# EAGLE design board1 (EAGLE 8.6.0)
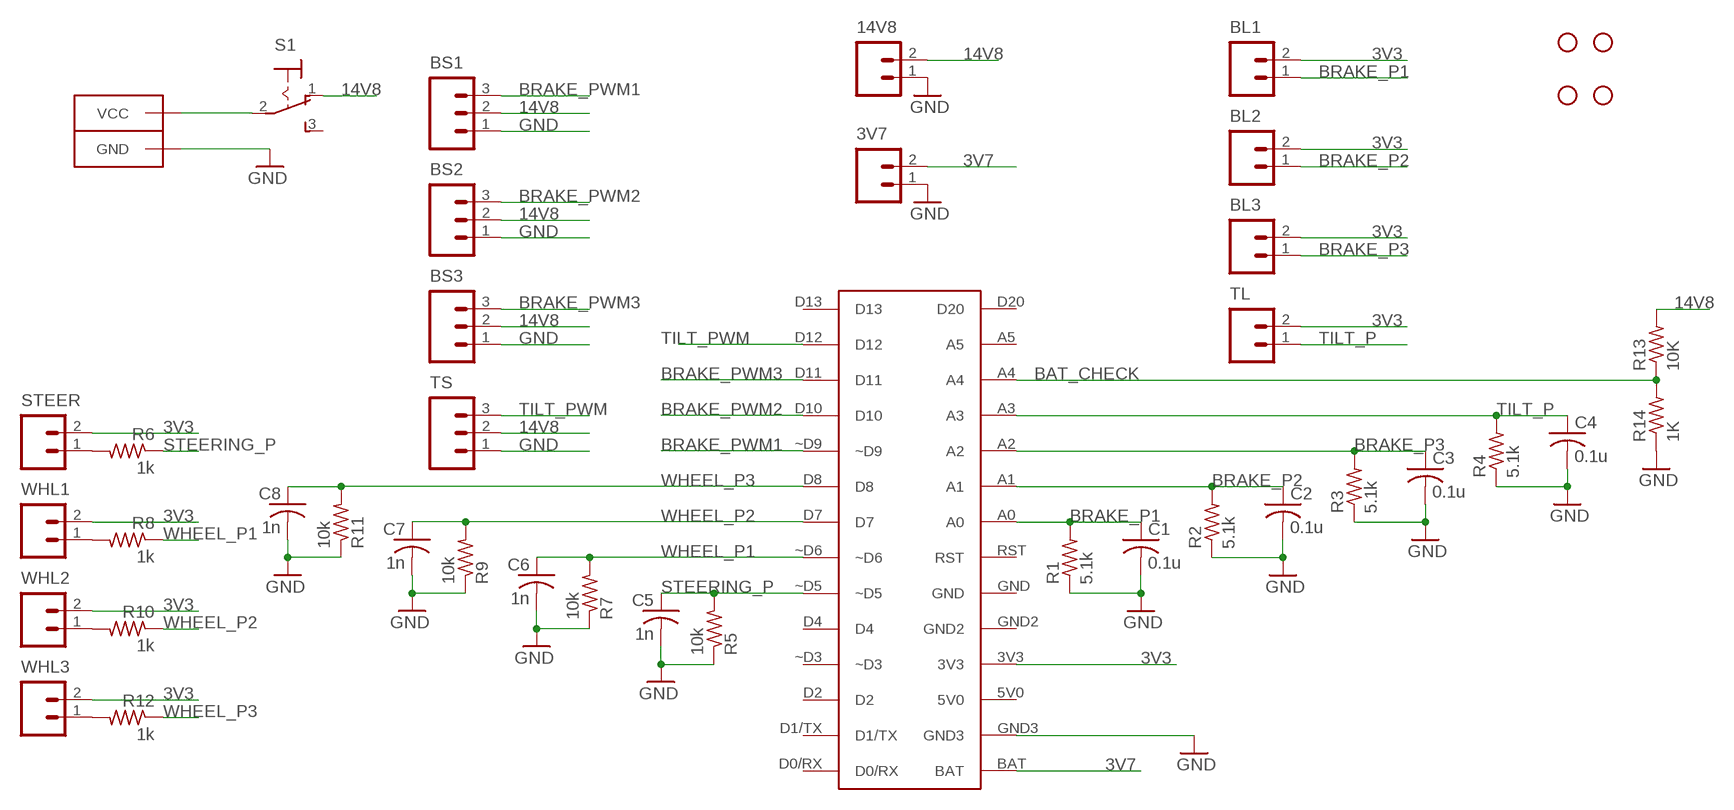
[diagram p0: schematic, sheet 1]

## Parts
3V7  M02PTH  [1X02]
14V8  M02PTH  [1X02]
BL1  M02PTH  [1X02]
BL2  M02PTH  [1X02]
BL3  M02PTH  [1X02]
BS1  M03PTH  [1X03]
BS2  M03PTH  [1X03]
BS3  M03PTH  [1X03]
C1  0.1u  C-USC0603  [C0603]
C2  0.1u  C-USC0603  [C0603]
C3  0.1u  C-USC0603  [C0603]
C4  0.1u  C-USC0603  [C0603]
C5  1n  C-USC0603  [C0603]
C6  1n  C-USC0603  [C0603]
C7  1n  C-USC0603  [C0603]
C8  1n  C-USC0603  [C0603]
JP13  STAND-OFF  [STAND-OFF]
JP14  STAND-OFF  [STAND-OFF]
JP15  STAND-OFF  [STAND-OFF]
JP16  STAND-OFF  [STAND-OFF]
LIPO  ANDERSONHORIZONTAL  [ANDERSON_HORIZONTAL]
R1  5.1k  R-US_R0603  [R0603]
R2  5.1k  R-US_R0603  [R0603]
R3  5.1k  R-US_R0603  [R0603]
R4  5.1k  R-US_R0603  [R0603]
R5  10k  R-US_R0603  [R0603]
R6  1k  R-US_R0603  [R0603]
R7  10k  R-US_R0603  [R0603]
R8  1k  R-US_R0603  [R0603]
R9  10k  R-US_R0603  [R0603]
R10  1k  R-US_R0603  [R0603]
R11  10k  R-US_R0603  [R0603]
R12  1k  R-US_R0603  [R0603]
R13  10K  R-US_R0603  [R0603]
R14  1K  R-US_R0603  [R0603]
S1  M9040P  [M9040P]
STEER  M02PTH  [1X02]
TL  M02PTH  [1X02]
TS  M03PTH  [1X03]
U$1  CURIENANO_BREAKOUT  [CURIENANO]
WHL1  M02PTH  [1X02]
WHL2  M02PTH  [1X02]
WHL3  M02PTH  [1X02]

## Nets
3V3: BL1.2 BL2.2 BL3.2 STEER.2 TL.2 U$1.3V3 WHL1.2 WHL2.2 WHL3.2
3V7: 3V7.2 U$1.BAT
14V8: 14V8.2 BS1.2 BS2.2 BS3.2 R13.2 S1.1(O) TS.2
BAT_CHECK: R13.1 R14.2 U$1.A4
BRAKE_P1: BL1.1 C1.1 R1.2 U$1.A0
BRAKE_P2: BL2.1 C2.1 R2.2 U$1.A1
BRAKE_P3: BL3.1 C3.1 R3.2 U$1.A2
BRAKE_PWM1: BS1.3 U$1.~D9
BRAKE_PWM2: BS2.3 U$1.D10
BRAKE_PWM3: BS3.3 U$1.D11
GND: 3V7.1 14V8.1 BS1.1 BS2.1 BS3.1 C1.2 C2.2 C3.2 C4.2 C5.2 C6.2 C7.2 C8.2 LIPO.PIN1(GND) LIPO.PIN1-LEAD(GND) R1.1 R2.1 R3.1 R4.1 R5.1 R7.1 R9.1 R11.1 R14.1 TS.1 U$1.GND3
N$1: R6.2 STEER.1
N$2: R8.2 WHL1.1
N$3: R10.2 WHL2.1
N$4: R12.2 WHL3.1
N$5: LIPO.PIN2(VCC) LIPO.PIN2-LEAD(VCC) S1.2(P)
STEERING_P: C5.1 R5.2 R6.1 U$1.~D5
TILT_P: C4.1 R4.2 TL.1 U$1.A3
TILT_PWM: TS.3 U$1.D12
WHEEL_P1: C6.1 R7.2 R8.1 U$1.~D6
WHEEL_P2: C7.1 R9.2 R10.1 U$1.D7
WHEEL_P3: C8.1 R11.2 R12.1 U$1.D8
Unconnected: S1.3(S) U$1.5V0 U$1.A5 U$1.D0/RX U$1.D1/TX U$1.D2 U$1.D4 U$1.D13 U$1.D20 U$1.GND U$1.GND2 U$1.RST U$1.~D3

## Library data of the parts
3V7 14V8 BL1-BL3 STEER TL WHL1-WHL3 = ee192:M02: 2-pin 0.1-inch header and MTA connector Courtsey of Pioneers in Engineering; PIE-INT-REF-NUM: BULK-STOCK
BS1-BS3 TS = ee192:M03: 3-pin 0.1-inch header and MTA connector Courtsey of Pioneers in Engineering; PIE-INT-REF-NUM: BULK-STOCK
C1-C8 = adafruit:C-US: CAPACITOR, American symbol
JP13-JP16 = ee192:STAND-OFF: Stand Off This is the mechanical footprint for a #4 phillips button head screw. Use the keepout ring to avoid running the screw head into surrounding components. SKU : PRT-00447
LIPO = ee192:ANDERSON: 2-pin 25A Anderson Connector http://www.alliedelec.com/images/products/datasheets/bm/ANDERSON_POWER_PRODUCTS/70162018.pdf; PIE-INT-REF-NUM: Anderson
R1-R14 = resistor:R-US_: RESISTOR, American symbol
S1 = switch:M9040P: TOGGLE SWITCH Marquardt
U$1 = Curie Nano:CURIENANO_BREAKOUT

## Net classes
0 default: width 0.508 mm

## Board
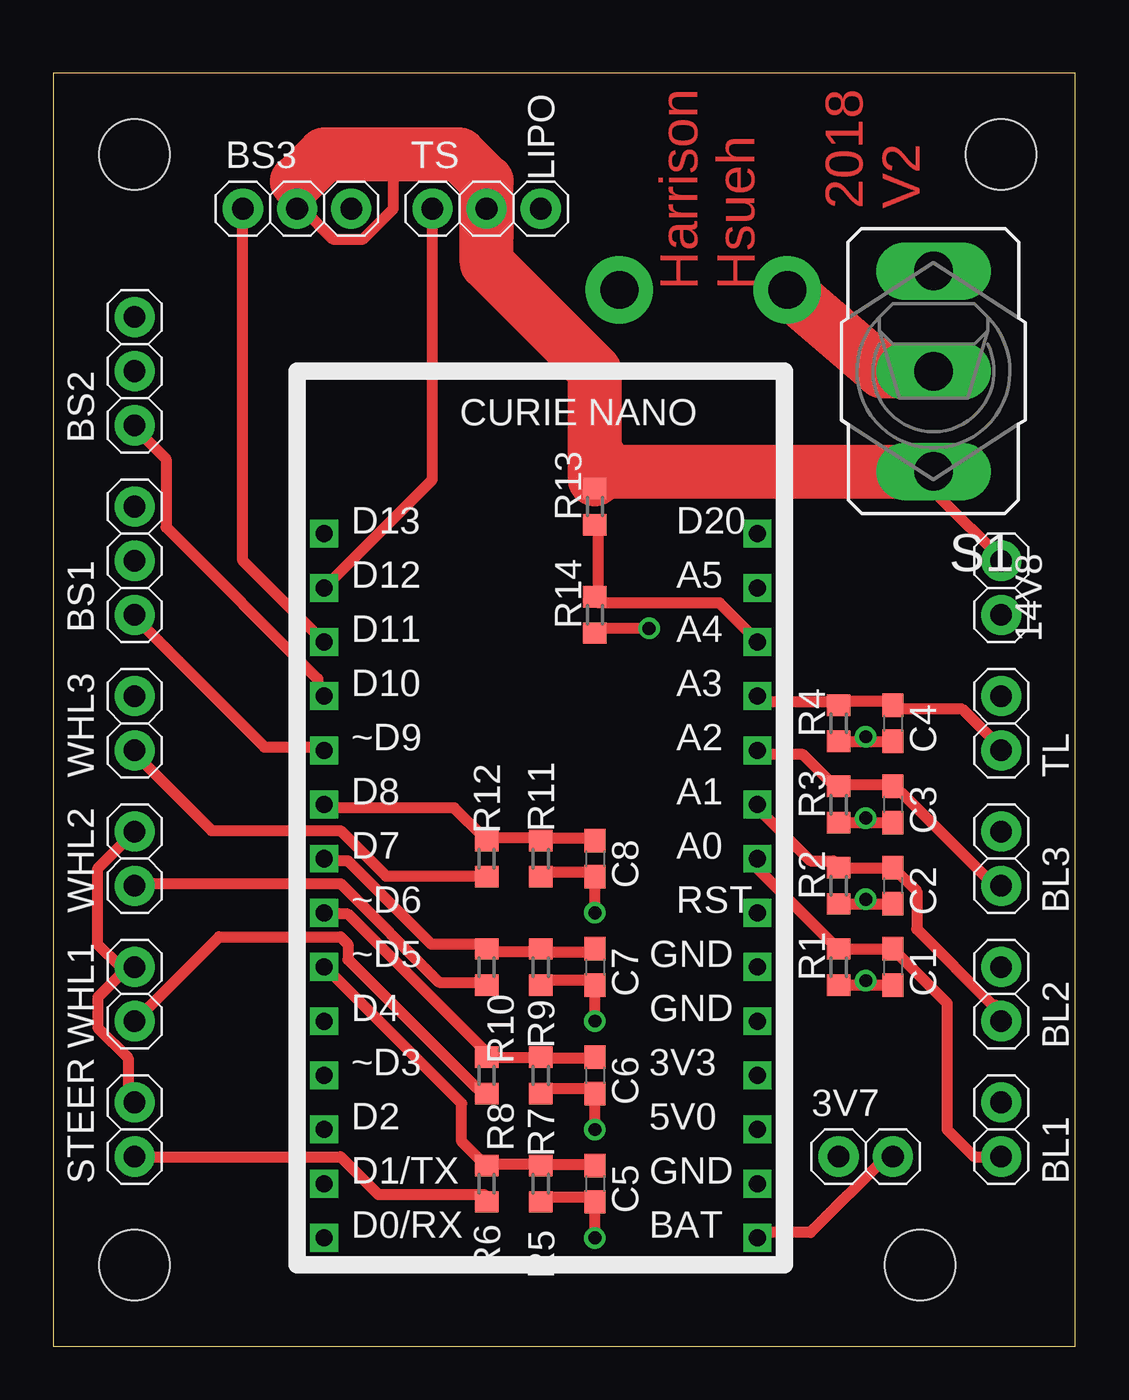
[diagram p1: board, top side]
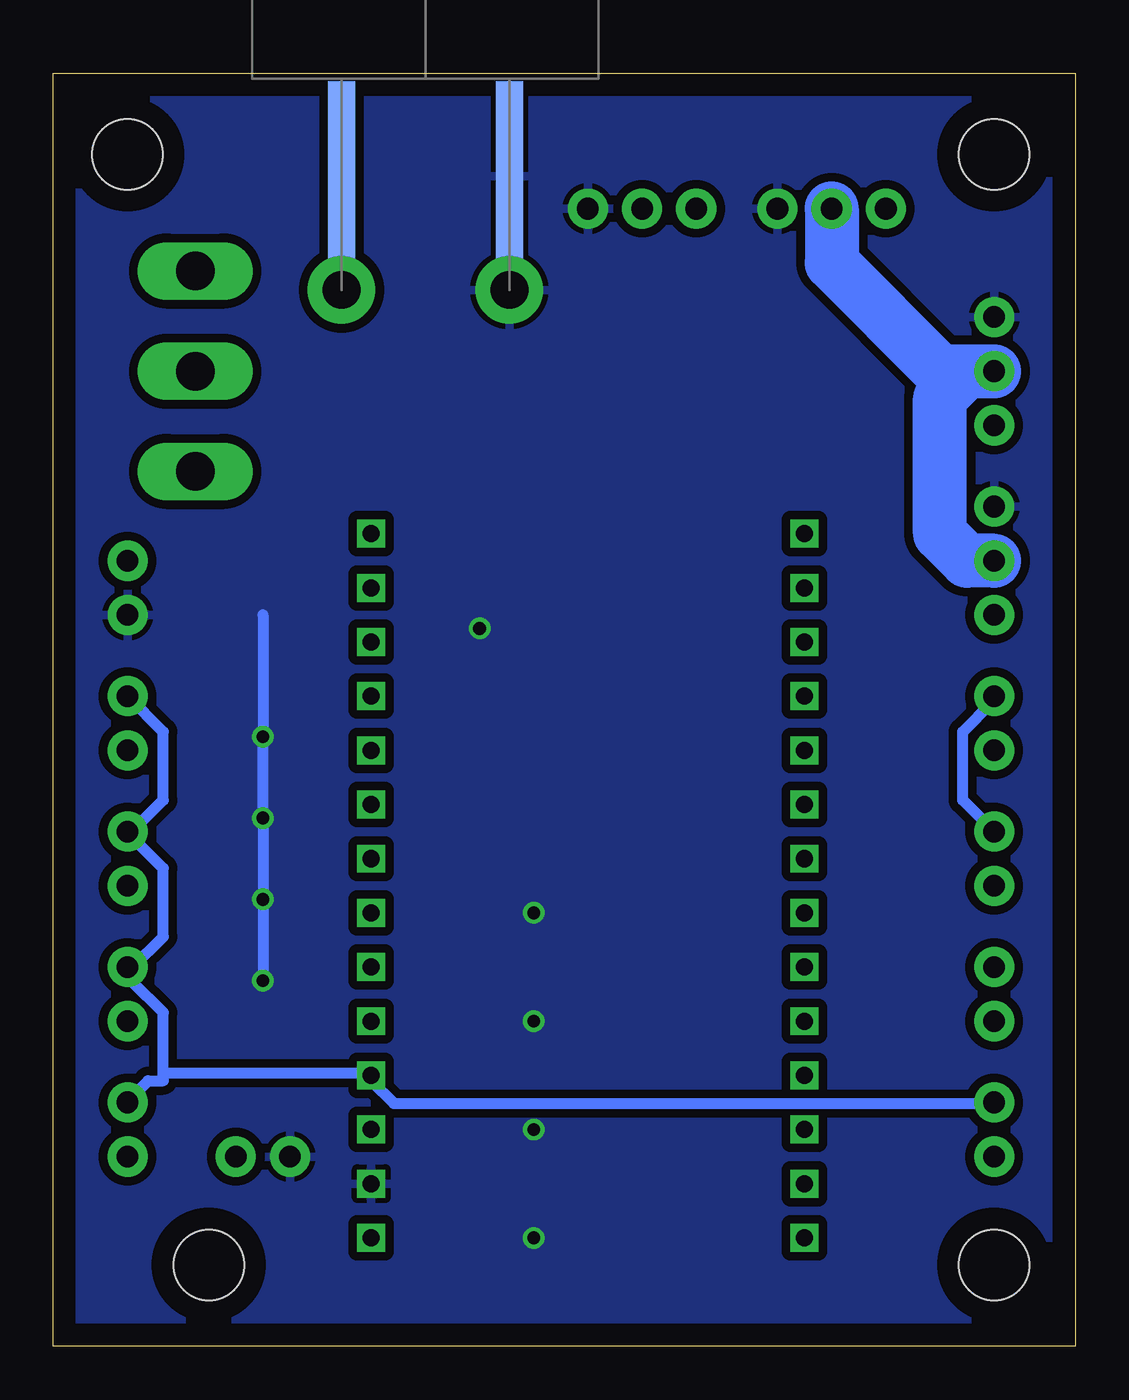
[diagram p2: board, bottom side, seen from below]

Size 47.93 x 59.68 mm. Coordinates in mm from the lower left corner, seen from the top.
Outline: 0,0 47.93,0 47.93,59.68 0,59.68 0,0
Copper layers (1*16): Top 0.035mm / dielectric 1.5mm / Bottom 0.035mm
Design rules "default": minimum track width 10mil, minimum drill 0.6mm, track to track 8mil, track to pad 8mil, pad to pad 8mil, via to via 8mil, smd to smd 8mil, copper to edge 40mil, drill to drill 8mil, minimum pad ring 10mil, minimum via ring 8mil, stop-mask expansion 4mil, vias tented up to drill 0mil, thermal gap 10mil

### Footprints (pad centres in the part's own frame; a part is rotated, then mirrored left to right if it is on the bottom)
1X02 = drill 1.016 pad 1.88: 1 -1.27,0; 2 1.27,0
1X03 = drill 1.016 pad 1.88: 1 -2.54,0; 2 0,0; 3 2.54,0
C0603 = smd 1.1 x 1: 1 -0.85,0; 2 0.85,0
STAND-OFF = hole 3.302: 0,0
ANDERSON_HORIZONTAL = drill 1.778 pad 3.175: PIN1 0,3.937; PIN2 0,-3.937 | smd 8.89 x 1.27: PIN1-LEAD -5.334,3.937; PIN2-LEAD -5.334,-3.937
R0603 = smd 1 x 1.1: 1 -0.85,0; 2 0.85,0
M9040P = drill 1.803 long: 1 0,4.699; 2 0,0; 3 0,-4.699
CURIENANO = drill 0.8 square: 3V3 20.32,7.62; 5V0 20.32,5.08; A0 20.32,17.78; A1 20.32,20.32; A2 20.32,22.86; A3 20.32,25.4; A4 20.32,27.94; A5 20.32,30.48; BAT 20.32,0; D0/RX 0,0; D1/TX 0,2.54; D2 0,5.08; D4 0,10.16; D7 0,17.78; D8 0,20.32; D10 0,25.4; D11 0,27.94; D12 0,30.48; D13 0,33.02; D20 20.32,33.02; GND 20.32,12.7; GND2 20.32,10.16; GND3 20.32,2.54; RST 20.32,15.24; ~D3 0,7.62; ~D5 0,12.7; ~D6 0,15.24; ~D9 0,22.86

### Placement (x,y rotation side)
3V7  38.1,8.89 0 top
14V8  44.45,35.56 90 top
BL1  44.45,10.16 90 top
BL2  44.45,16.51 90 top
BL3  44.45,22.86 90 top
BS1  3.81,36.83 270 top
BS2  3.81,45.72 270 top
BS3  11.43,53.34 180 top
C1  39.37,17.78 270 top
C2  39.37,21.59 270 top
C3  39.37,25.4 270 top
C4  39.37,29.21 270 top
C5  25.4,7.62 270 top
C6  25.4,12.7 270 top
C7  25.4,17.78 270 top
C8  25.4,22.86 270 top
JP13  3.81,3.81 0 top
JP14  40.64,3.81 0 top
JP15  3.81,55.88 0 top
JP16  44.45,55.88 0 top
LIPO  30.48,49.53 270 bottom
R1  36.83,17.78 90 top
R2  36.83,21.59 90 top
R3  36.83,25.4 90 top
R4  36.83,29.21 90 top
R5  22.86,7.62 90 top
R6  20.32,7.62 270 top
R7  22.86,12.7 90 top
R8  20.32,12.7 270 top
R9  22.86,17.78 90 top
R10  20.32,17.78 270 top
R11  22.86,22.86 90 top
R12  20.32,22.86 270 top
R13  25.4,39.37 90 top
R14  25.4,34.29 90 top
S1  41.27,45.72 180 top
STEER  3.81,10.16 90 top
TL  44.45,29.21 90 top
TS  20.32,53.34 180 top
U$1  12.7,5.08 0 top
WHL1  3.81,16.51 90 top
WHL2  3.81,22.86 90 top
WHL3  3.81,29.21 90 top

### Tracks (layer width: path | path; a pad name or v marks a point on that pad's centre or on a via)
3V3
  Top 0.508: STEER.2 3.5,11.73 3.5,13.51 2.08,14.94 2.08,16.36 3.5,17.78 WHL1.2 3.15,17.78 2.08,18.85 2.08,22.4 WHL2.2
  Bottom 0.508: WHL2.2 5.28,25.6 5.28,28.8 3.86,30.23 WHL3.2 | BL1.2 44.2,11.73 43.48,12.45 42.77,12.45 42.77,12.8 | 44.2,17.78 44.2,17.07 42.77,15.65 42.77,12.8 | 44.2,17.78 42.77,19.2 42.77,22.4 44.2,23.82 BL3.2 44.2,24.18 42.77,25.6 42.77,28.8 TL.2 | 44.2,17.78 BL2.2 | STEER.2 3.86,11.38 31.95,11.38 33.02,12.45 U$1.3V3 33.02,12.8 42.77,12.8
3V7
  Top 0.508: U$1.BAT 33.02,5.33 35.51,5.33 39.06,8.89 3V7.2
14V8
  Top 0.508: 14V8.2 44.4,36.98 41.55,39.83 S1.1 | 15.95,55.88 15.95,53.34 14.53,51.92 13.11,51.92 11.68,53.34 BS3.2
  Top 1.27: R13.2 25.4,40.64
  Top 2.54: TS.2 20.32,54.61 19.05,55.88 15.95,55.88 12.7,55.88 11.43,54.61 | TS.2 20.32,52.07 | 25.4,41.91 25.4,45.72 20.32,50.8 TS.2 | 25.4,41.91 25.4,40.64 25.78,41.02 S1.1 | 25.6,41.71 25.4,41.91
  Bottom 2.54: 5.08,45.72 BS2.2 | BS3.2 11.43,50.8 6.35,45.72 5.08,45.72 | BS1.2 5.08,36.83 6.35,38.1 6.35,44.45 5.08,45.72
BAT_CHECK
  Top 0.508: R13.1 25.55,38.41 25.55,35.2 R14.2 25.55,34.85 31.24,34.85 33.02,33.07 U$1.A4
BRAKE_P1
  Top 0.508: U$1.A0 33.02,22.4 36.58,18.85 R1.2 C1.1 41.91,16.09 41.91,10.16 43.18,8.89 BL1.1
BRAKE_P2
  Top 0.508: 44.2,16 44.2,15.29 BL2.1 44.04,16 40.49,19.56 40.49,21.34 39.42,22.4 C2.1 39.06,22.4 36.93,22.4 R2.2 36.58,22.76 35.51,22.76 33.02,25.25 U$1.A1
BRAKE_P3
  Top 0.508: 44.2,21.69 BL3.1 44.04,21.69 39.78,25.96 39.42,25.96 C3.1 39.06,26.31 36.93,26.31 R3.2 36.58,26.31 35.15,27.74 33.02,27.74 U$1.A2
BRAKE_PWM1
  Top 0.508: U$1.~D9 12.4,28.09 9.91,28.09 3.86,34.14 BS1.3
BRAKE_PWM2
  Top 0.508: U$1.D10 12.4,30.58 12.4,31.29 5.28,38.41 5.28,41.6 3.86,43.03 BS2.3
BRAKE_PWM3
  Top 0.508: U$1.D11 8.89,36.83 BS3.3
GND  (via drill 0.6)
  Top 0.508: R11.1 22.86,22.23 25.4,22.23 C8.2 v25.4,20.32 | R9.1 22.86,17.14 25.4,17.14 C7.2 v25.4,15.24 | R7.1 22.86,12.06 25.4,12.06 C6.2 v25.4,10.16 | R5.1 22.86,6.99 25.4,6.99 C5.2 v25.4,5.08 | v27.94,33.66 25.4,33.66 R14.1 | R4.1 38.1,28.36 | 38.1,28.36 C4.2 | R3.1 38.1,24.55 | 38.1,24.55 C3.2 | R2.1 38.1,20.74 | 38.1,20.74 C2.2 | R1.1 38.1,16.93 | 38.1,16.93 C1.2 | v38.1,17.14 38.1,16.93 | v38.1,20.95 38.1,20.74 | v38.1,24.77 38.1,24.55 | v38.1,28.57 38.1,28.36
  Bottom 0.508: v38.1,17.14 v38.1,20.95 v38.1,24.77 v38.1,28.57 38.1,34.29
  pour Bottom (isolate 0.406): 1.27,58.42 1.27,1.27 46.99,1.27 46.99,58.42
N$1
  Top 0.508: STEER.1 13.46,8.89 15.24,7.11 20.22,7.11 R6.2
N$2
  Top 0.508: WHL1.1 7.77,19.2 13.46,19.2 13.82,18.85 13.82,18.14 19.86,12.09 20.22,12.09 R8.2
N$3
  Top 0.508: R10.2 20.22,17.07 18.09,17.07 13.46,21.69 3.86,21.69 WHL2.1
N$4
  Top 0.508: R12.2 20.22,22.05 15.6,22.05 13.46,24.18 7.42,24.18 3.86,27.74 WHL3.1
N$5
  Top 2.54: LIPO.PIN2 38.86,45.72 S1.2
  Bottom 0.508: LIPO.PIN2-LEAD 34.44,55.47 34.44,50.49 LIPO.PIN2
STEERING_P
  Top 0.508: C5.1 25.2,8.53 23.06,8.53 R5.2 22.71,8.53 20.57,8.53 R6.1 20.22,8.53 19.15,9.6 19.15,11.38 12.75,17.78 U$1.~D5
TILT_P
  Top 0.508: U$1.A3 33.02,30.23 36.58,30.23 R4.2 36.93,30.23 39.06,30.23 C4.1 39.42,29.87 42.62,29.87 44.4,28.09 TL.1
TILT_PWM
  Top 0.508: U$1.D12 17.78,40.64 TS.3
WHEEL_P1
  Top 0.508: C6.1 25.2,13.51 23.06,13.51 R7.2 22.71,13.51 20.57,13.51 R8.1 20.22,13.87 13.82,20.27 12.75,20.27 U$1.~D6
WHEEL_P2
  Top 0.508: C7.1 25.2,18.49 23.06,18.49 R9.2 22.71,18.49 20.57,18.49 R10.1 20.22,18.85 17.73,18.85 13.82,22.76 12.75,22.76 U$1.D7
WHEEL_P3
  Top 0.508: C8.1 25.2,23.82 23.06,23.82 R11.2 22.71,23.82 20.57,23.82 R12.1 20.22,23.82 18.8,25.25 12.75,25.25 U$1.D8

### Text on the board
Top: 2018 / V2 | Harrison / Hsueh